# Altium project ARM2.5.PrjPcb
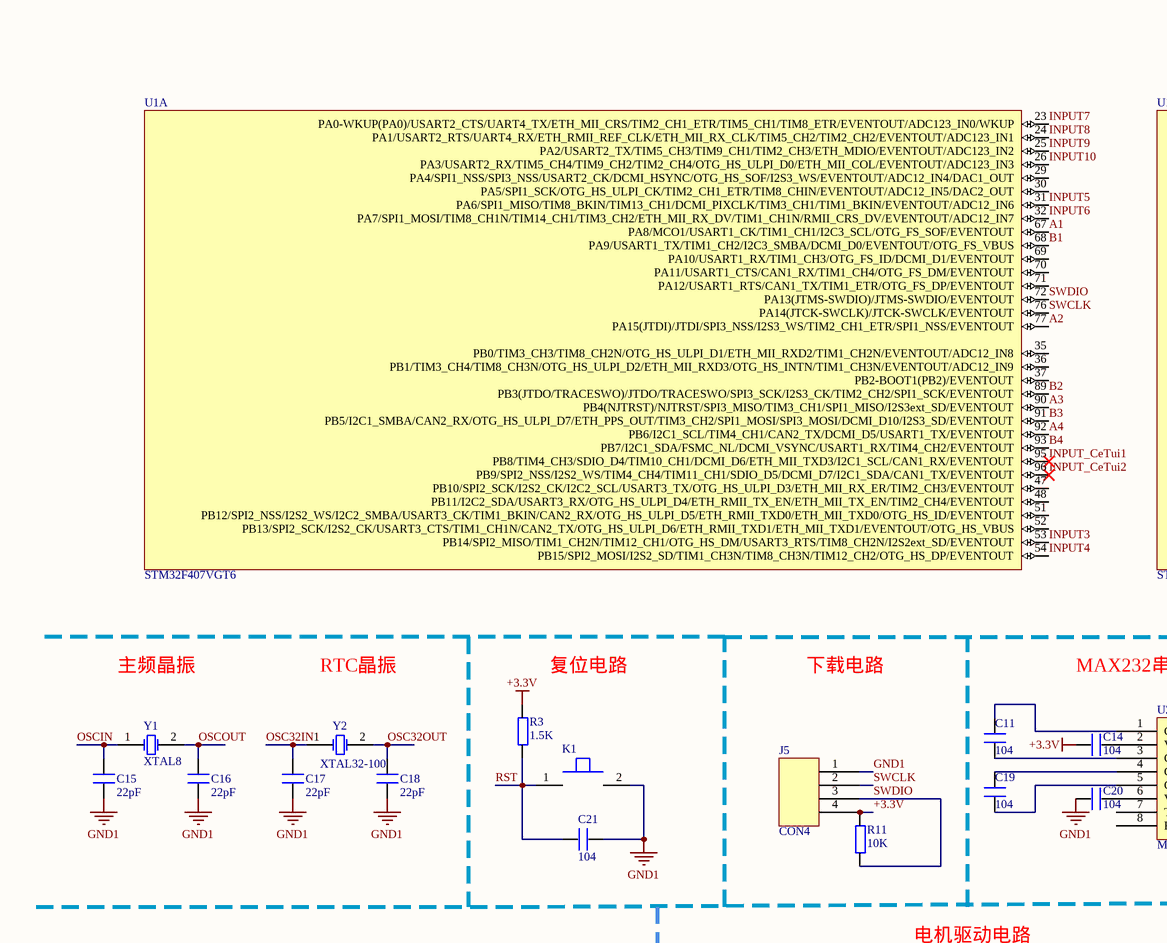
[diagram p0: RD.SchDoc, top left]
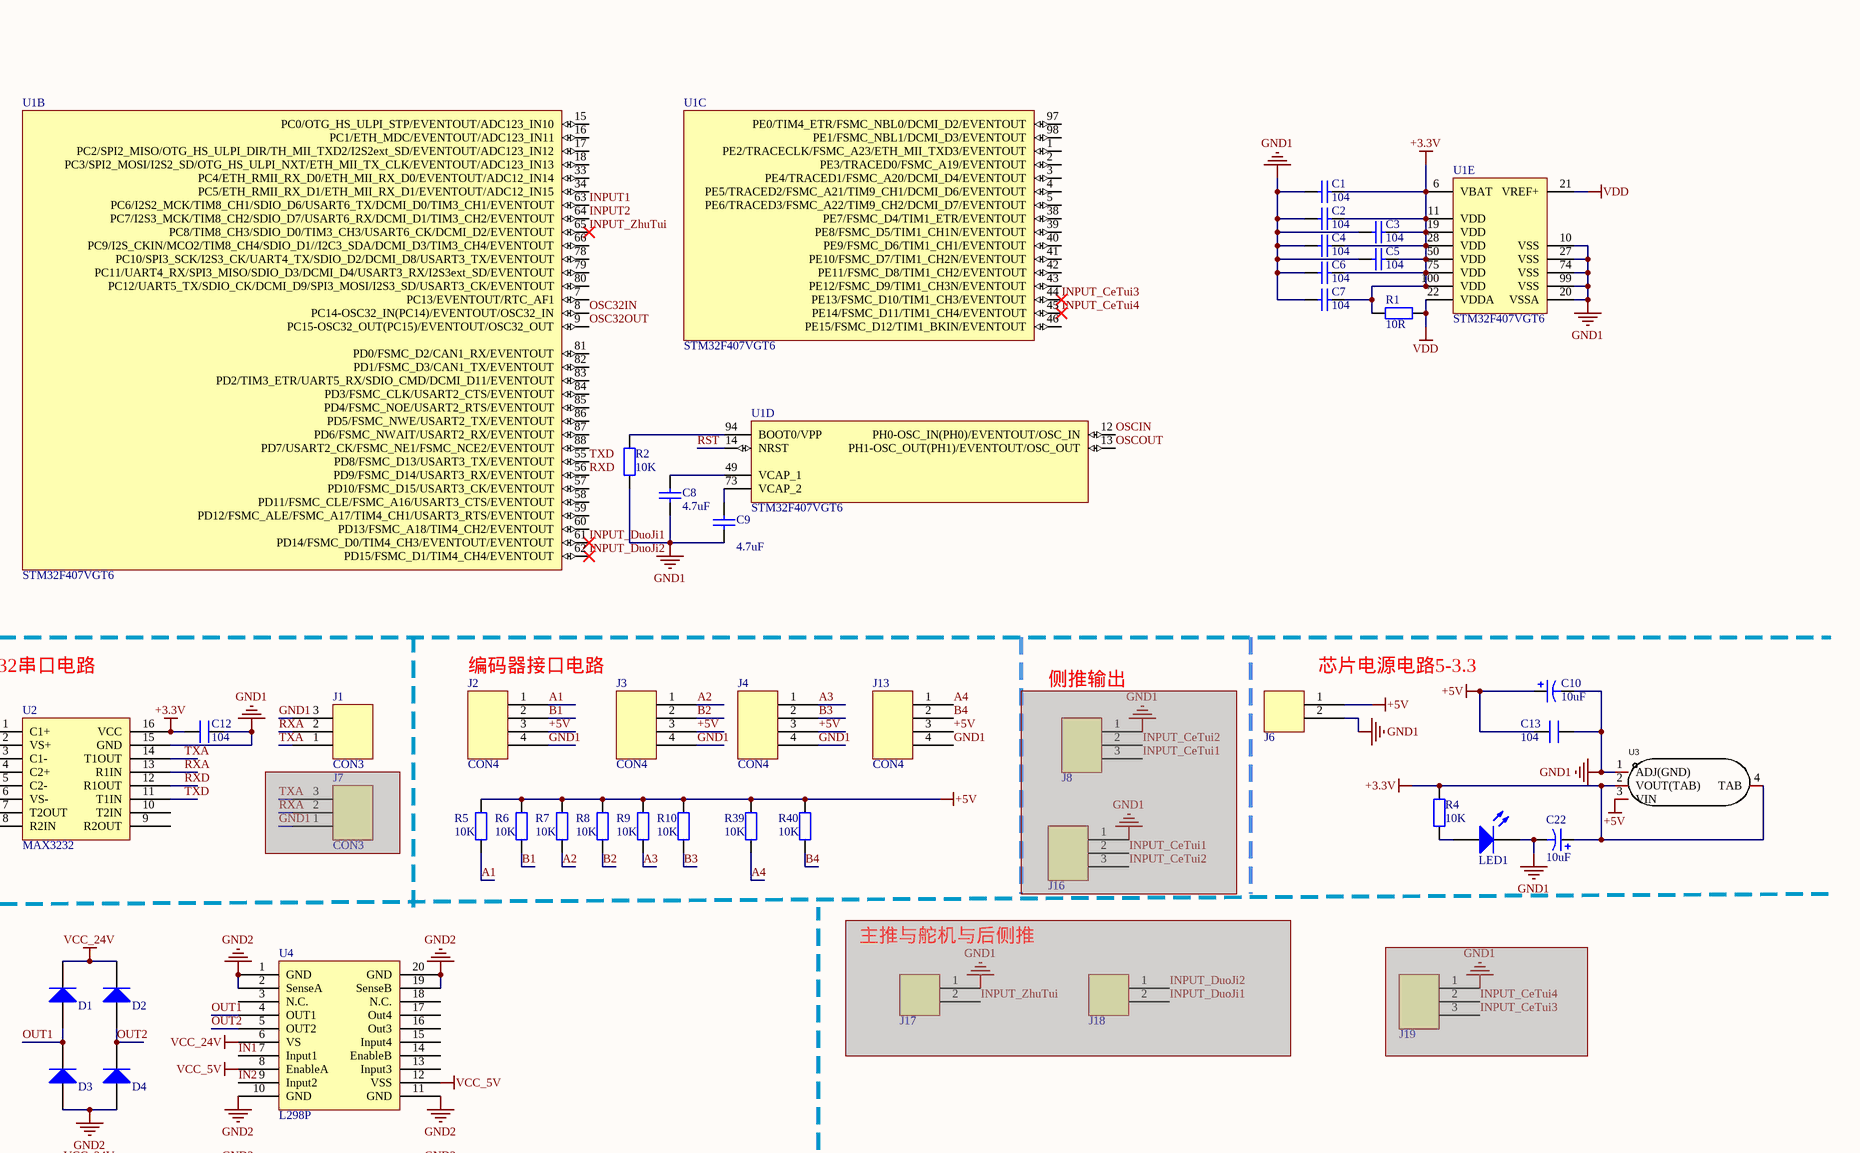
[diagram p1: RD.SchDoc, top right]
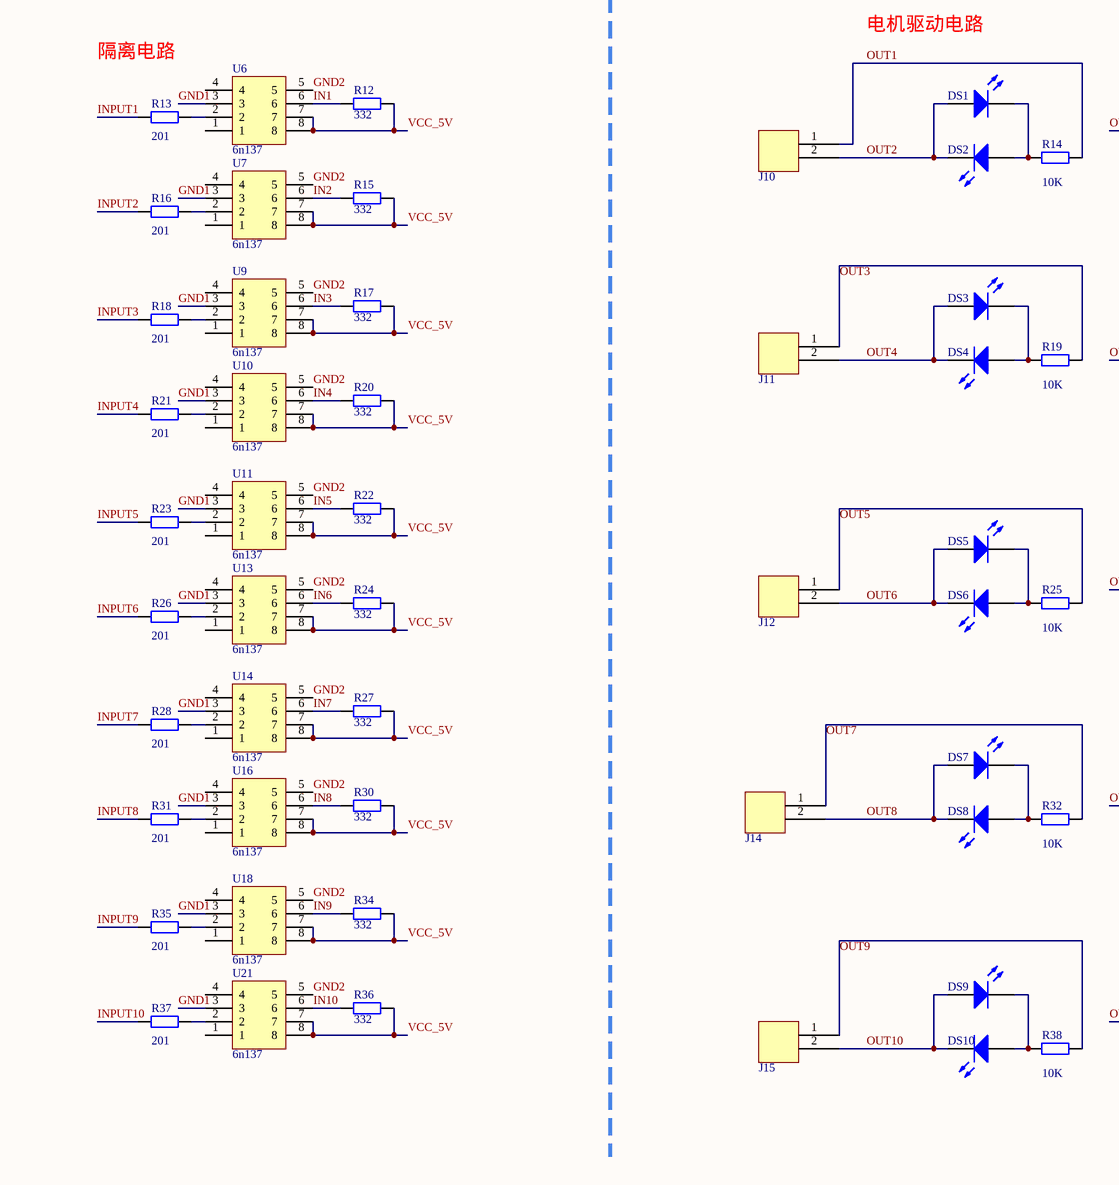
[diagram p2: RD.SchDoc, bottom left]
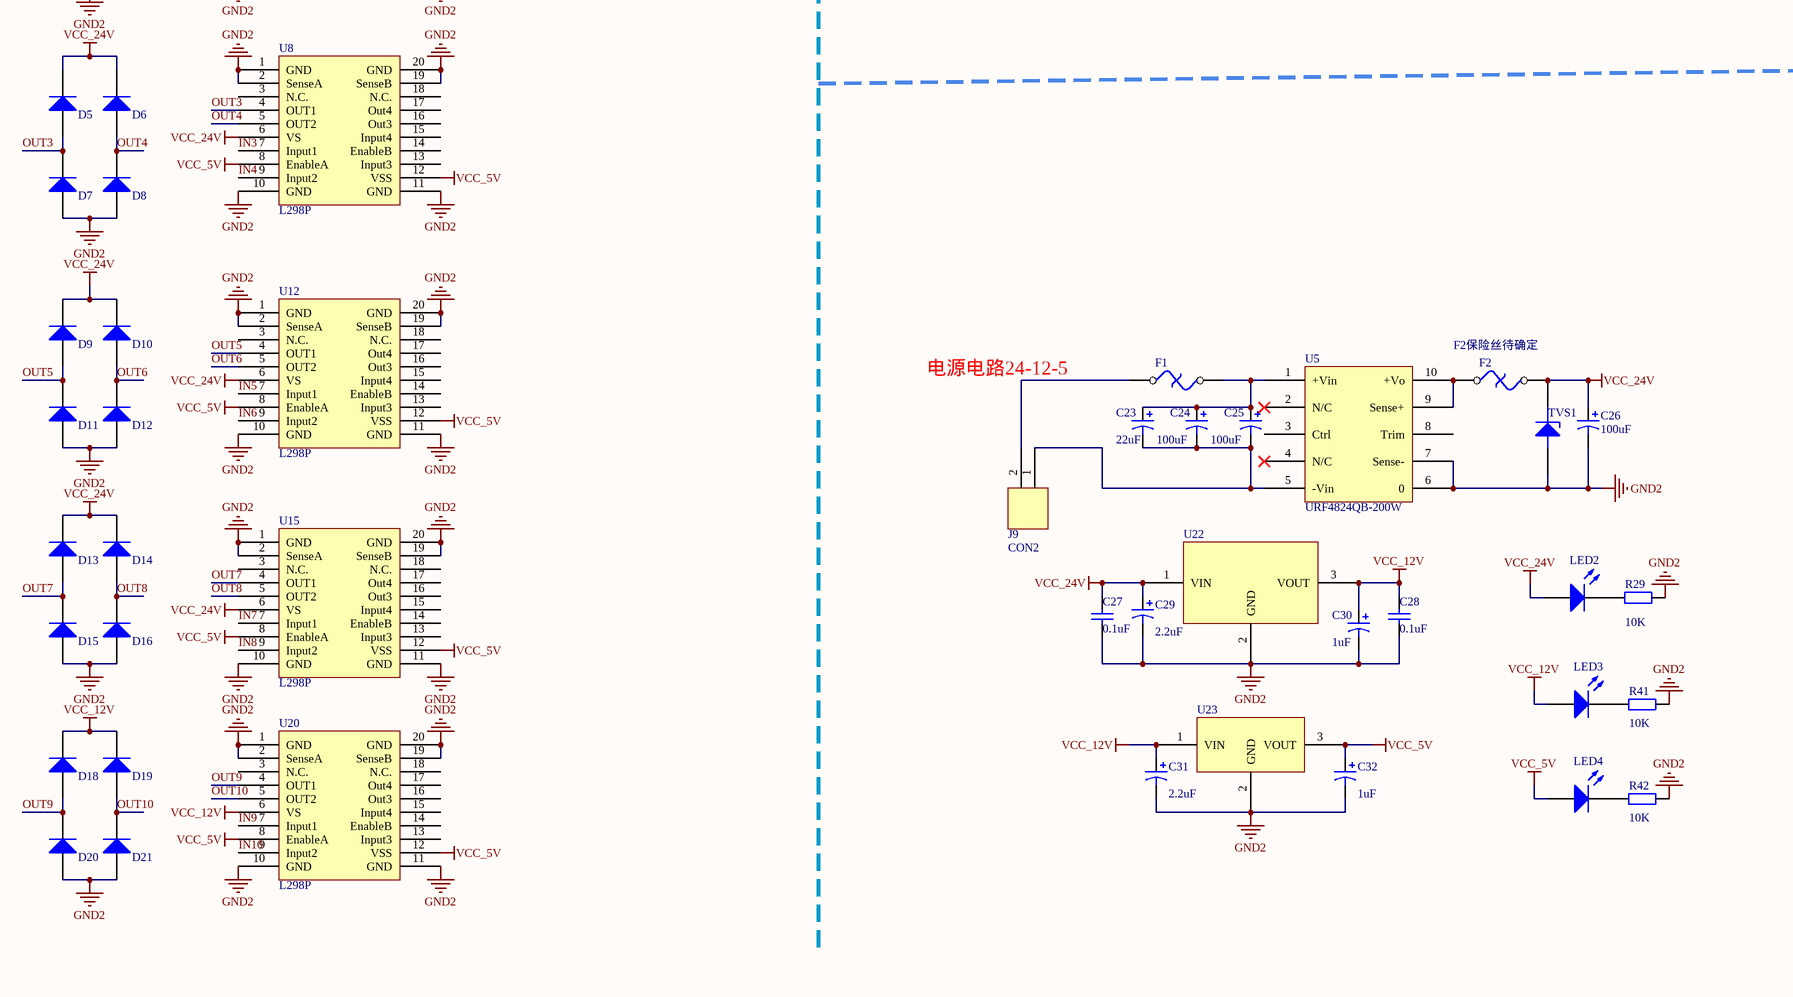
[diagram p3: RD.SchDoc, bottom right]
1 sheet, 153 parts. Net scope: global (net labels, ports and power ports of the same name join across sheets).
Board files: ARM2-2.5.PcbDoc, RD.PcbDoc

## Sheet RD.SchDoc
size A2

### Parts
C1  104  [0805]
C2  104  [0805]
C3  104  [0805]
C4  104  [0805]
C5  104  [0805]
C6  104  [0805]
C7  104  [0805]
C8  4.7uF  [0805]
C9  4.7uF  [0805]
C10  value 10uF  [钽电容小]  (hidden comment: Cap Pol1)
C11  104  [0805]
C12  104  [0805]
C13  104  [0805]
C14  104  [0805]
C15  22pF  [0805]
C16  22pF  [0805]
C17  22pF  [0805]
C18  22pF  [0805]
C19  104  [0805]
C20  104  [0805]
C21  104  [0805]
C22  value 10uF  [钽电容小]  (hidden comment: Cap Pol1)
C23  value 22uF  [钽电容大]  (hidden comment: Cap Pol1)
C24  value 100uF  [钽电容大]  (hidden comment: Cap Pol1)
C25  value 100uF  [钽电容大]  (hidden comment: Cap Pol1)
C26  value 100uF  [钽电容大]  (hidden comment: Cap Pol1)
C27  0.1uF  [0805]
C28  0.1uF  [0805]
C29  value 2.2uF  [钽电容小]  (hidden comment: Cap Pol1)
C30  value 1uF  [钽电容小]  (hidden comment: Cap Pol1)
C31  value 2.2uF  [钽电容小]  (hidden comment: Cap Pol1)
C32  value 1uF  [钽电容小]  (hidden comment: Cap Pol1)
D1  Diode 1N4149  [肖特基二极管SS34]  (value not drawn)
D2  Diode 1N4149  [肖特基二极管SS34]  (value not drawn)
D3  Diode 1N4149  [肖特基二极管SS34]  (value not drawn)
D4  Diode 1N4149  [肖特基二极管SS34]  (value not drawn)
D5  Diode 1N4149  [肖特基二极管SS34]  (value not drawn)
D6  Diode 1N4149  [肖特基二极管SS34]  (value not drawn)
D7  Diode 1N4149  [肖特基二极管SS34]  (value not drawn)
D8  Diode 1N4149  [肖特基二极管SS34]  (value not drawn)
D9  Diode 1N4149  [肖特基二极管SS34]  (value not drawn)
D10  Diode 1N4149  [肖特基二极管SS34]  (value not drawn)
D11  Diode 1N4149  [肖特基二极管SS34]  (value not drawn)
D12  Diode 1N4149  [肖特基二极管SS34]  (value not drawn)
D13  Diode 1N4149  [肖特基二极管SS34]  (value not drawn)
D14  Diode 1N4149  [肖特基二极管SS34]  (value not drawn)
D15  Diode 1N4149  [肖特基二极管SS34]  (value not drawn)
D16  Diode 1N4149  [肖特基二极管SS34]  (value not drawn)
D18  Diode 1N4149  [肖特基二极管SS34]  (value not drawn)
D19  Diode 1N4149  [肖特基二极管SS34]  (value not drawn)
D20  Diode 1N4149  [肖特基二极管SS34]  (value not drawn)
D21  Diode 1N4149  [肖特基二极管SS34]  (value not drawn)
DS1  LED  [0805]  (value not drawn)
DS2  LED  [0805]  (value not drawn)
DS3  LED  [0805]  (value not drawn)
DS4  LED  [0805]  (value not drawn)
DS5  LED  [0805]  (value not drawn)
DS6  LED  [0805]  (value not drawn)
DS7  LED  [0805]  (value not drawn)
DS8  LED  [0805]  (value not drawn)
DS9  LED  [0805]  (value not drawn)
DS10  LED  [0805]  (value not drawn)
F1  THERMAL FUSE  [1206]  (value not drawn)
F2  THERMAL FUSE  [1206]  (value not drawn)
J1  CON3  [CON3BB]
J2  CON4  [CONN4B]
J3  CON4  [CONN4B]
J4  CON4  [CONN4B]
J5  CON4  [CON4]
J6  CON2  [CONN-TH_2P-P3.81_DB2EVC-3.81-2P-BK]  (value not drawn)
J7  CON3  [CON3B]  (masked out: inside a compile mask, not in the netlist)
J8  CON3  [CON3]  (value not drawn)  (masked out: inside a compile mask, not in the netlist)
J9  CON2  [CONN-TH_2P-P3.81_DB2EVC-3.81-2P-BK]
J10  CON2  [CONN-TH_2P-P3.81_DB2EVC-3.81-2P-BK]  (value not drawn)
J11  CON2  [CONN-TH_2P-P3.81_DB2EVC-3.81-2P-BK]  (value not drawn)
J12  CON2  [CONN-TH_2P-P3.81_DB2EVC-3.81-2P-BK]  (value not drawn)
J13  CON4  [CONN4B]
J14  CON2  [CONN-TH_2P-P3.81_DB2EVC-3.81-2P-BK]  (value not drawn)
J15  CON2  [CONN-TH_2P-P3.81_DB2EVC-3.81-2P-BK]  (value not drawn)
J16  CON3  [CONN-TH_3P-P3.81_DB2EVC-3.81-3P]  (value not drawn)  (masked out: inside a compile mask, not in the netlist)
J17  CON2  [CONN-TH_2P-P3.81_DB2EVC-3.81-2P-BK]  (value not drawn)  (masked out: inside a compile mask, not in the netlist)
J18  CON2  [CONN-TH_2P-P3.81_DB2EVC-3.81-2P-BK]  (value not drawn)  (masked out: inside a compile mask, not in the netlist)
J19  CON3  [CON3BB]  (value not drawn)  (masked out: inside a compile mask, not in the netlist)
K1  KEY4  [按钮]  (value not drawn)
LED1  LED  [0805]  (value not drawn)
LED2  LED  [0805]  (value not drawn)
LED3  LED  [0805]  (value not drawn)
LED4  LED  [0805]  (value not drawn)
R1  10R  [0805]
R2  10K  [0805]
R3  1.5K  [0805]
R4  10K  [0805]
R5  10K  [0805]
R6  10K  [0805]
R7  10K  [0805]
R8  10K  [0805]
R9  10K  [0805]
R10  10K  [0805]
R11  10K  [0805]
R12  332  [0805]
R13  201  [0805]
R14  10K  [0805]
R15  332  [0805]
R16  201  [0805]
R17  332  [0805]
R18  201  [0805]
R19  10K  [0805]
R20  332  [0805]
R21  201  [0805]
R22  332  [0805]
R23  201  [0805]
R24  332  [0805]
R25  10K  [0805]
R26  201  [0805]
R27  332  [0805]
R28  201  [0805]
R29  value 10K  [0805]  (hidden comment: Res2)
R30  332  [0805]
R31  201  [0805]
R32  10K  [0805]
R34  332  [0805]
R35  201  [0805]
R36  332  [0805]
R37  201  [0805]
R38  10K  [0805]
R39  10K  [0805]
R40  10K  [0805]
R41  10K  [0805]
R42  10K  [0805]
TVS1  TVS  [tvs]  (value not drawn)
U1  STM32F407VGT6  [STM32F407VGT6]  (parts A,B,C,D,E of 5)
U2  MAX3232  [max3232]
U3  AMS1117-3.3_C347222  [AMS1117]  (value not drawn)
U4  L298P  [L298P]
U5  URF4824QB-200W  [URF4824QB-200W（24稳压）]
U6  6n137  [6n137]
U7  6n137  [6n137]
U8  L298P  [L298P]
U9  6n137  [6n137]
U10  6n137  [6n137]
U11  6n137  [6n137]
U12  L298P  [L298P]
U13  6n137  [6n137]
U14  6n137  [6n137]
U15  L298P  [L298P]
U16  6n137  [6n137]
U18  6n137  [6n137]
U20  L298P  [L298P]
U21  6n137  [6n137]
U22  7812  [7812]  (value not drawn)
U23  7805  [7805]  (value not drawn)
Y1  XTAL8  [XTAL8（晶振）]
Y2  XTAL32-100  [XTAL32-100（晶振）]

### Nets
+3.3V: C1.1 C2.1 C3.1 C4.1 C5.1 C6.1 C7.1 C12.1 C14.2 C22.1 J5.4 R1.2 R3.2 R4.2 R11.2 U1.6(VBAT) U1.11(VDD) U1.19(VDD) U1.28(VDD) U1.50(VDD) U1.75(VDD) U1.100(VDD) U2.16(VCC) U3.2(VOUT(TAB)) U3.4(TAB)
+5V: C10.1 C13.2 J2.3 J3.3 J4.3 J6.1 J13.3 R5.2 R6.2 R7.2 R8.2 R9.2 R10.2 R39.2 R40.2 U3.3(VIN)
GND1: C1.2 C2.2 C3.2 C4.2 C5.2 C6.2 C7.2 C8.1 C9.1 C10.2 C12.2 C13.1 C15.1 C16.1 C17.1 C18.1 C20.1 C21.2 C22.2 J1.3 J2.4 J3.4 J4.4 J5.1 J6.2 J13.4 K1.2 LED1.2(K) R2.2 U1.10(VSS) U1.20(VSSA) U1.27(VSS) U1.74(VSS) U1.99(VSS) U2.15(GND) U3.1(ADJ(GND)) U6.3 U7.3 U9.3 U10.3 U11.3 U13.3 U14.3 U16.3 U18.3 U21.3
GND2: C26.2 C27.1 C28.1 C29.2 C30.2 C31.2 C32.2 D3.2(A) D4.2(A) D7.2(A) D8.2(A) D11.2(A) D12.2(A) D15.2(A) D16.2(A) D20.2(A) D21.2(A) R29.2 R41.2 R42.2 TVS1.1(A) U4.1(GND) U4.2(SenseA) U4.10(GND) U4.11(GND) U4.19(SenseB) U4.20(GND) U5.6(0) U5.7(Sense-) U6.5 U7.5 U8.1(GND) U8.2(SenseA) U8.10(GND) U8.11(GND) U8.19(SenseB) U8.20(GND) U9.5 U10.5 U11.5 U12.1(GND) U12.2(SenseA) U12.10(GND) U12.11(GND) U12.19(SenseB) U12.20(GND) U13.5 U14.5 U15.1(GND) U15.2(SenseA) U15.10(GND) U15.11(GND) U15.19(SenseB) U15.20(GND) U16.5 U18.5 U20.1(GND) U20.2(SenseA) U20.10(GND) U20.11(GND) U20.19(SenseB) U20.20(GND) U21.5 U22.2(GND) U23.2(GND)
VCC_5V: C32.1 LED4.1(A) R12.1 R15.1 R17.1 R20.1 R22.1 R24.1 R27.1 R30.1 R34.1 R36.1 U4.8(EnableA) U4.12(VSS) U6.7 U6.8 U7.7 U7.8 U8.8(EnableA) U8.12(VSS) U9.7 U9.8 U10.7 U10.8 U11.7 U11.8 U12.8(EnableA) U12.12(VSS) U13.7 U13.8 U14.7 U14.8 U15.8(EnableA) U15.12(VSS) U16.7 U16.8 U18.7 U18.8 U20.8(EnableA) U20.12(VSS) U21.7 U21.8 U23.3(VOUT)
VCC_12V: C28.2 C30.1 C31.1 D18.1(K) D19.1(K) LED3.1(A) U20.6(VS) U22.3(VOUT) U23.1(VIN)
VCC_24V: C26.1 C27.2 C29.1 D1.1(K) D2.1(K) D5.1(K) D6.1(K) D9.1(K) D10.1(K) D13.1(K) D14.1(K) F2.2 LED2.1(A) TVS1.2(K) U4.6(VS) U8.6(VS) U12.6(VS) U15.6(VS) U22.1(VIN)
VDD: R1.1 U1.21(VREF+) U1.22(VDDA)
A1: J2.1 R5.1 U1.67(PA8/MCO1/USART1_CK/TIM1_CH1/I2C3_SCL/OTG_FS_SOF/EVENTOUT)
A2: J3.1 R7.1 U1.77(PA15(JTDI)/JTDI/SPI3_NSS/I2S3_WS/TIM2_CH1_ETR/SPI1_NSS/EVENTOUT)
A3: J4.1 R9.1 U1.90(PB4(NJTRST)/NJTRST/SPI3_MISO/TIM3_CH1/SPI1_MISO/I2S3ext_SD/EVENTOUT)
A4: J13.1 R39.1 U1.92(PB6/I2C1_SCL/TIM4_CH1/CAN2_TX/DCMI_D5/USART1_TX/EVENTOUT)
B1: J2.2 R6.1 U1.68(PA9/USART1_TX/TIM1_CH2/I2C3_SMBA/DCMI_D0/EVENTOUT/OTG_FS_VBUS)
B2: J3.2 R8.1 U1.89(PB3(JTDO/TRACESWO)/JTDO/TRACESWO/SPI3_SCK/I2S3_CK/TIM2_CH2/SPI1_SCK/EVENTOUT)
B3: J4.2 R10.1 U1.91(PB5/I2C1_SMBA/CAN2_RX/OTG_HS_ULPI_D7/ETH_PPS_OUT/TIM3_CH2/SPI1_MOSI/SPI3_MOSI/DCMI_D10/I2S3_SD/EVENTOUT)
B4: J13.2 R40.1 U1.93(PB7/I2C1_SDA/FSMC_NL/DCMI_VSYNC/USART1_RX/TIM4_CH2/EVENTOUT)
IN1: R12.2 U4.7(Input1) U6.6
IN2: R15.2 U4.9(Input2) U7.6
IN3: R17.2 U8.7(Input1) U9.6
IN4: R20.2 U8.9(Input2) U10.6
IN5: R22.2 U11.6 U12.7(Input1)
IN6: R24.2 U12.9(Input2) U13.6
IN7: R27.2 U14.6 U15.7(Input1)
IN8: R30.2 U15.9(Input2) U16.6
IN9: R34.2 U18.6 U20.7(Input1)
IN10: R36.2 U20.9(Input2) U21.6
INPUT1: R13.1 U1.63(PC6/I2S2_MCK/TIM8_CH1/SDIO_D6/USART6_TX/DCMI_D0/TIM3_CH1/EVENTOUT)
INPUT2: R16.1 U1.64(PC7/I2S3_MCK/TIM8_CH2/SDIO_D7/USART6_RX/DCMI_D1/TIM3_CH2/EVENTOUT)
INPUT3: R18.1 U1.53(PB14/SPI2_MISO/TIM1_CH2N/TIM12_CH1/OTG_HS_DM/USART3_RTS/TIM8_CH2N/I2S2ext_SD/EVENTOUT)
INPUT4: R21.1 U1.54(PB15/SPI2_MOSI/I2S2_SD/TIM1_CH3N/TIM8_CH3N/TIM12_CH2/OTG_HS_DP/EVENTOUT)
INPUT5: R23.1 U1.31(PA6/SPI1_MISO/TIM8_BKIN/TIM13_CH1/DCMI_PIXCLK/TIM3_CH1/TIM1_BKIN/EVENTOUT/ADC12_IN6)
INPUT6: R26.1 U1.32(PA7/SPI1_MOSI/TIM8_CH1N/TIM14_CH1/TIM3_CH2/ETH_MII_RX_DV/TIM1_CH1N/RMII_CRS_DV/EVENTOUT/ADC12_IN7)
INPUT7: R28.1 U1.23(PA0-WKUP(PA0)/USART2_CTS/UART4_TX/ETH_MII_CRS/TIM2_CH1_ETR/TIM5_CH1/TIM8_ETR/EVENTOUT/ADC123_IN0/WKUP)
INPUT8: R31.1 U1.24(PA1/USART2_RTS/UART4_RX/ETH_RMII_REF_CLK/ETH_MII_RX_CLK/TIM5_CH2/TIM2_CH2/EVENTOUT/ADC123_IN1)
INPUT9: R35.1 U1.25(PA2/USART2_TX/TIM5_CH3/TIM9_CH1/TIM2_CH3/ETH_MDIO/EVENTOUT/ADC123_IN2)
INPUT10: R37.1 U1.26(PA3/USART2_RX/TIM5_CH4/TIM9_CH2/TIM2_CH4/OTG_HS_ULPI_D0/ETH_MII_COL/EVENTOUT/ADC123_IN3)
INPUT_CeTui1: U1.95(PB8/TIM4_CH3/SDIO_D4/TIM10_CH1/DCMI_D6/ETH_MII_TXD3/I2C1_SCL/CAN1_RX/EVENTOUT)
INPUT_CeTui2: U1.96(PB9/SPI2_NSS/I2S2_WS/TIM4_CH4/TIM11_CH1/SDIO_D5/DCMI_D7/I2C1_SDA/CAN1_TX/EVENTOUT)
INPUT_CeTui3: U1.44(PE13/FSMC_D10/TIM1_CH3/EVENTOUT)
INPUT_CeTui4: U1.45(PE14/FSMC_D11/TIM1_CH4/EVENTOUT)
INPUT_DuoJi1: U1.61(PD14/FSMC_D0/TIM4_CH3/EVENTOUT/EVENTOUT)
INPUT_DuoJi2: U1.62(PD15/FSMC_D1/TIM4_CH4/EVENTOUT)
INPUT_ZhuTui: U1.65(PC8/TIM8_CH3/SDIO_D0/TIM3_CH3/USART6_CK/DCMI_D2/EVENTOUT)
OSC32IN: C17.2 U1.8(PC14-OSC32_IN(PC14)/EVENTOUT/OSC32_IN) Y2.1(OSC1)
OSC32OUT: C18.2 U1.9(PC15-OSC32_OUT(PC15)/EVENTOUT/OSC32_OUT) Y2.2(OSC2)
OSCIN: C15.2 U1.12(PH0-OSC_IN(PH0)/EVENTOUT/OSC_IN) Y1.1(OSC1)
OSCOUT: C16.2 U1.13(PH1-OSC_OUT(PH1)/EVENTOUT/OSC_OUT) Y1.2(OSC2)
OUT1: D1.2(A) D3.1(K) J10.1 R14.2 U4.4(OUT1)
OUT2: D2.2(A) D4.1(K) DS1.1 DS2.2(K) J10.2 U4.5(OUT2)
OUT3: D5.2(A) D7.1(K) J11.1 R19.2 U8.4(OUT1)
OUT4: D6.2(A) D8.1(K) DS3.1(A) DS4.2(K) J11.2 U8.5(OUT2)
OUT5: D9.2(A) D11.1(K) J12.1 R25.2 U12.4(OUT1)
OUT6: D10.2(A) D12.1(K) DS5.1(A) DS6.2(K) J12.2 U12.5(OUT2)
OUT7: D13.2(A) D15.1(K) J14.1 R32.2 U15.4(OUT1)
OUT8: D14.2(A) D16.1(K) DS7.1(A) DS8.2(K) J14.2 U15.5(OUT2)
OUT9: D18.2(A) D20.1(K) J15.1 R38.2 U20.4(OUT1)
OUT10: D19.2(A) D21.1(K) DS9.1(A) DS10.2(K) J15.2 U20.5(OUT2)
RST: C21.1 K1.1 R3.1 U1.14(NRST)
RXA: J1.2 U2.13(R1IN)
RXD: U1.56(PD9/FSMC_D14/USART3_RX/EVENTOUT) U2.12(R1OUT)
SWCLK: J5.2 U1.76(PA14(JTCK-SWCLK)/JTCK-SWCLK/EVENTOUT)
SWDIO: J5.3 R11.1 U1.72(PA13(JTMS-SWDIO)/JTMS-SWDIO/EVENTOUT)
TXA: J1.1 U2.14(T1OUT)
TXD: U1.55(PD8/FSMC_D13/USART3_TX/EVENTOUT) U2.11(T1IN)
NetC8_2: C8.2 U1.49(VCAP_1)
NetC9_2: C9.2 U1.73(VCAP_2)
NetC11_1: C11.1 U2.3(C1-)
NetC11_2: C11.2 U2.1(C1+)
NetC14_1: C14.1 U2.2(VS+)
NetC19_1: C19.1 U2.5(C2-)
NetC19_2: C19.2 U2.4(C2+)
NetC20_2: C20.2 U2.6(VS-)
NetC23_1: C23.1 C24.1 C25.1 F1.2 U5.1(+Vin)
NetC23_2: C23.2 C24.2 C25.2 J9.1 U5.5(-Vin)
NetDS1_2: DS1.2 DS2.1(A) R14.1
NetDS3_2: DS3.2(K) DS4.1(A) R19.1
NetDS5_2: DS5.2(K) DS6.1(A) R25.1
NetDS7_2: DS7.2(K) DS8.1(A) R32.1
NetDS9_2: DS9.2(K) DS10.1(A) R38.1
NetF1_1: F1.1 J9.2
NetF2_1: F2.1 U5.9(Sense+) U5.10(+Vo)
NetLED1_1: LED1.1(A) R4.1
NetLED2_2: LED2.2(K) R29.1
NetLED3_2: LED3.2(K) R41.1
NetLED4_2: LED4.2(K) R42.1
NetR2_1: R2.1 U1.94(BOOT0/VPP)
NetR13_2: R13.2 U6.2
NetR16_2: R16.2 U7.2
NetR18_2: R18.2 U9.2
NetR21_2: R21.2 U10.2
NetR23_2: R23.2 U11.2
NetR26_2: R26.2 U13.2
NetR28_2: R28.2 U14.2
NetR31_2: R31.2 U16.2
NetR35_2: R35.2 U18.2
NetR37_2: R37.2 U21.2

Not connected (* = marked no-connect by the designer): U1 1(PE2/TRACECLK/FSMC_A23/ETH_MII_TXD3/EVENTOUT) 2(PE3/TRACED0/FSMC_A19/EVENTOUT) 3(PE4/TRACED1/FSMC_A20/DCMI_D4/EVENTOUT) 4(PE5/TRACED2/FSMC_A21/TIM9_CH1/DCMI_D6/EVENTOUT) 5(PE6/TRACED3/FSMC_A22/TIM9_CH2/DCMI_D7/EVENTOUT) 7(PC13/EVENTOUT/RTC_AF1) 15(PC0/OTG_HS_ULPI_STP/EVENTOUT/ADC123_IN10) 16(PC1/ETH_MDC/EVENTOUT/ADC123_IN11) 17(PC2/SPI2_MISO/OTG_HS_ULPI_DIR/TH_MII_TXD2/I2S2ext_SD/EVENTOUT/ADC123_IN12) 18(PC3/SPI2_MOSI/I2S2_SD/OTG_HS_ULPI_NXT/ETH_MII_TX_CLK/EVENTOUT/ADC123_IN13) 29(PA4/SPI1_NSS/SPI3_NSS/USART2_CK/DCMI_HSYNC/OTG_HS_SOF/I2S3_WS/EVENTOUT/ADC12_IN4/DAC1_OUT) 30(PA5/SPI1_SCK/OTG_HS_ULPI_CK/TIM2_CH1_ETR/TIM8_CHIN/EVENTOUT/ADC12_IN5/DAC2_OUT) 33(PC4/ETH_RMII_RX_D0/ETH_MII_RX_D0/EVENTOUT/ADC12_IN14) 34(PC5/ETH_RMII_RX_D1/ETH_MII_RX_D1/EVENTOUT/ADC12_IN15) 35(PB0/TIM3_CH3/TIM8_CH2N/OTG_HS_ULPI_D1/ETH_MII_RXD2/TIM1_CH2N/EVENTOUT/ADC12_IN8) 36(PB1/TIM3_CH4/TIM8_CH3N/OTG_HS_ULPI_D2/ETH_MII_RXD3/OTG_HS_INTN/TIM1_CH3N/EVENTOUT/ADC12_IN9) 37(PB2-BOOT1(PB2)/EVENTOUT) 38(PE7/FSMC_D4/TIM1_ETR/EVENTOUT) 39(PE8/FSMC_D5/TIM1_CH1N/EVENTOUT) 40(PE9/FSMC_D6/TIM1_CH1/EVENTOUT) 41(PE10/FSMC_D7/TIM1_CH2N/EVENTOUT) 42(PE11/FSMC_D8/TIM1_CH2/EVENTOUT) 43(PE12/FSMC_D9/TIM1_CH3N/EVENTOUT) 46(PE15/FSMC_D12/TIM1_BKIN/EVENTOUT) 47(PB10/SPI2_SCK/I2S2_CK/I2C2_SCL/USART3_TX/OTG_HS_ULPI_D3/ETH_MII_RX_ER/TIM2_CH3/EVENTOUT) 48(PB11/I2C2_SDA/USART3_RX/OTG_HS_ULPI_D4/ETH_RMII_TX_EN/ETH_MII_TX_EN/TIM2_CH4/EVENTOUT) 51(PB12/SPI2_NSS/I2S2_WS/I2C2_SMBA/USART3_CK/TIM1_BKIN/CAN2_RX/OTG_HS_ULPI_D5/ETH_RMII_TXD0/ETH_MII_TXD0/OTG_HS_ID/EVENTOUT) 52(PB13/SPI2_SCK/I2S2_CK/USART3_CTS/TIM1_CH1N/CAN2_TX/OTG_HS_ULPI_D6/ETH_RMII_TXD1/ETH_MII_TXD1/EVENTOUT/OTG_HS_VBUS) 57(PD10/FSMC_D15/USART3_CK/EVENTOUT) 58(PD11/FSMC_CLE/FSMC_A16/USART3_CTS/EVENTOUT) 59(PD12/FSMC_ALE/FSMC_A17/TIM4_CH1/USART3_RTS/EVENTOUT) 60(PD13/FSMC_A18/TIM4_CH2/EVENTOUT) 66(PC9/I2S_CKIN/MCO2/TIM8_CH4/SDIO_D1//I2C3_SDA/DCMI_D3/TIM3_CH4/EVENTOUT) 69(PA10/USART1_RX/TIM1_CH3/OTG_FS_ID/DCMI_D1/EVENTOUT) 70(PA11/USART1_CTS/CAN1_RX/TIM1_CH4/OTG_FS_DM/EVENTOUT) 71(PA12/USART1_RTS/CAN1_TX/TIM1_ETR/OTG_FS_DP/EVENTOUT) 78(PC10/SPI3_SCK/I2S3_CK/UART4_TX/SDIO_D2/DCMI_D8/USART3_TX/EVENTOUT) 79(PC11/UART4_RX/SPI3_MISO/SDIO_D3/DCMI_D4/USART3_RX/I2S3ext_SD/EVENTOUT) 80(PC12/UART5_TX/SDIO_CK/DCMI_D9/SPI3_MOSI/I2S3_SD/USART3_CK/EVENTOUT) 81(PD0/FSMC_D2/CAN1_RX/EVENTOUT) 82(PD1/FSMC_D3/CAN1_TX/EVENTOUT) 83(PD2/TIM3_ETR/UART5_RX/SDIO_CMD/DCMI_D11/EVENTOUT) 84(PD3/FSMC_CLK/USART2_CTS/EVENTOUT) 85(PD4/FSMC_NOE/USART2_RTS/EVENTOUT) 86(PD5/FSMC_NWE/USART2_TX/EVENTOUT) 87(PD6/FSMC_NWAIT/USART2_RX/EVENTOUT) 88(PD7/USART2_CK/FSMC_NE1/FSMC_NCE2/EVENTOUT) 97(PE0/TIM4_ETR/FSMC_NBL0/DCMI_D2/EVENTOUT) 98(PE1/FSMC_NBL1/DCMI_D3/EVENTOUT); U2 7(T2OUT) 8(R2IN) 9(R2OUT) 10(T2IN); U4 3(N.C.) 13(Input3) 14(EnableB) 15(Input4) 16(Out3) 17(Out4) 18(N.C.); U5 2(N/C)* 3(Ctrl) 4(N/C)* 8(Trim); U6 1 4; U7 1 4; U8 3(N.C.) 13(Input3) 14(EnableB) 15(Input4) 16(Out3) 17(Out4) 18(N.C.); U9 1 4; U10 1 4; U11 1 4; U12 3(N.C.) 13(Input3) 14(EnableB) 15(Input4) 16(Out3) 17(Out4) 18(N.C.); U13 1 4; U14 1 4; U15 3(N.C.) 13(Input3) 14(EnableB) 15(Input4) 16(Out3) 17(Out4) 18(N.C.); U16 1 4; U18 1 4; U20 3(N.C.) 13(Input3) 14(EnableB) 15(Input4) 16(Out3) 17(Out4) 18(N.C.); U21 1 4

### Notes on the sheet
- 主频晶振
- RTC晶振
- (near R3) 复位电路
- 下载电路
- MAX232串口电路
- (near J2) 编码器接口电路
- (near J8) 侧推输出
- (near J6) 芯片电源电路5-3.3
- 隔离电路
- 电机驱动电路
- (near J17) 主推与舵机与后侧推
- 电源电路24-12-5
- (near F2) F2保险丝待确定

### Library data of the parts
C1-C9 C27 C28 = Cap: Capacitor; Published: 8-Jun-2000; LatestRevisionDate: 17-Jul-2002; LatestRevisionNote: Re-released for DXP Platform.; PackageReference: RAD-0.3; Publisher: Altium Limited; PackageDescription: Radial Cap, Thru-Hole; 2 Leads; 0.3 in Pin Spacing
  C1-C7: Value: 104
  C8 C9: Value: 4.7uF
  C27 C28: Value: 0.1uF
C10 C22-C26 C29-C32 = Cap Pol1: Polarized Capacitor (Radial); Published: 8-Jun-2000; LatestRevisionDate: 17-Jul-2002; LatestRevisionNote: Re-released for DXP Platform.; PackageReference: RB7.6-15; Publisher: Altium Limited; PackageDescription: Polarized Capacitor (Radial); 2 Leads
C11-C21 = CAP
D1-D16 D18-D21 = Diode 1N4149: Computer Diode; Published: 8-Jun-2000; LatestRevisionDate: 17-Jul-2002; LatestRevisionNote: Re-released for DXP Platform.; DatasheetVersion: 1989; PackageVersion: 1989; PackageReference: DO-35A; Publisher: Altium Limited; PackageDescription: Diode, Axial; Body 4.6 x 1.9 mm (LxDia. max), Lead Dia. 0.53 mm (max); Code_JEDEC: DO-204-AH; ComponentLink1Description: Manufacturer Link; ComponentLink1URL: http://www.national.com/
R1 R2 R4-R10 R12-R32 R34-R42 = Res2: Resistor; Published: 8-Jun-2000; LatestRevisionDate: 17-Jul-2002; LatestRevisionNote: Re-released for DXP Platform.; PackageReference: AXIAL-0.4; Publisher: Altium Limited; PackageDescription: Axial Device, Thru-Hole; 2 Leads; 0.4 in Pin Spacing
  R1: Value: 10R
  R2 R4-R10 R14 R19 R25 R32 R38-R42: Value: 10K
  R12 R15 R17 R20 R22 R24 R27 R30 R34 R36: Value: 332
R3 R11 = RES
TVS1 = 稳压二极管: Zener Diode
U1 = STM32F407VGT6: ARM Cortex-M4 32b MCU+FPU, 210DMIP, 1024 kB Flash, 192+4 kB RAM, Camera, 82 I/Os, 100-pin LQFP, -40 to +85癈, Tray; Internal RAM: 192kB; Operating Frequency (Processor Speed): 168MHz; A/D Converter: 16x12-bit; D/A Converter: 2x12-bit; 16-bit Timers (IC/OC/PWM): 12x16-bit(24/24/30); 32-bit Timer (IC/OC/PWM): 2x32-bit (8/8/8); Other Timer Functions: 2xWDG, RTC, 24-bit down counter; Serial Interface: 3xSPI/2xI2S/2xI2C/3xUSART(IrDa, ISO7816)/3xUART/2xUSB OTG FS/HS, 2xCAN/Ethernet MAC10/100, SDIO; DatasheetVersion: rev2, Jan-2012; PackageVersion: 2012; PackageReference: LQFP100; PackageDescription: 100-Pin Low Profile Quad Flat Package, 14x14 mm Body, 0.5 mm Pitch; ComponentLink1Description: Manufacturer URL; ComponentLink1URL: http://www.st.com/; ComponentLink2Description: STM32F405/7 Datasheet; ComponentLink2URL: http://www.st.com/internet/com/TECHNICAL_RESOURCES/TECHNICAL_LITERATURE/DATASHEET/DM00037051.pdf; ComponentLink3Description: STM32F4 Web Page; ComponentLink3URL: http://www.st.com/internet/mcu/subclass/1521.jsp
U3 = AMS1117-3.3_C347222: Manufacturer: UMW(广东友台半导体); Add into BOM: yes; Output Type: 固定; Output Polarity: 正; Number of Outputs: 1; Maximum Input Voltage: 18V; Output Voltage: 3.3V; Dropout Voltage: 1.3V@(1A); Output Current: 1A; Power Supply Rejection Ratio (PSRR): 60dB@(120Hz); Name: AMS1117-3.3; Symbol: AMS1117-3.3_C347222; Device: AMS1117-3.3_C347222; LCSC Part Name: AMS1117-3.3; Supplier Part: C347222; Manufacturer Part: AMS1117-3.3; Supplier Footprint: SOT-223; JLCPCB Part Class: Extended Part; Datasheet: https://atta.szlcsc.com/upload/public/pdf/source/20211011/50CC665C22E3A66C08379A4A74BDA25C.pdf; Supplier: LCSC; Convert to PCB: yes
U22 = L7912CV
DS1-DS10 LED1-LED4 = LED: Published: 8-Jun-2000; LatestRevisionDate: 17-Jul-2002; LatestRevisionNote: Re-released for DXP Platform.; PackageDocument: Feb-2002; PackageReference: 3.2X1.6X1.1; Publisher: Altium Limited
Y1 = XTAL8: Published: 8-Jun-2000; LatestRevisionDate: 17-Jul-2002; LatestRevisionNote: Re-released for DXP Platform.; Publisher: Altium Limited
Y2 = XTAL32-100: Published: 8-Jun-2000; LatestRevisionDate: 17-Jul-2002; LatestRevisionNote: Re-released for DXP Platform.; Publisher: Altium Limited